# Altium schematic sheet 61204021621.SchDoc
size A; SheetNumber: 1; SheetTotal: 1
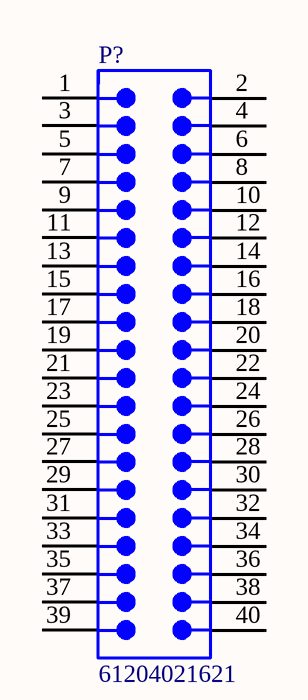
[diagram p0: 61204021621.SchDoc]

## Parts
P?  61204021621  [61204021621]

## Nets

Not connected (* = marked no-connect by the designer): P? 1 2 3 4 5 6 7 8 9 10 11 12 13 14 15 16 17 18 19 20 21 22 23 24 25 26 27 28 29 30 31 32 33 34 35 36 37 38 39 40

## Library data of the parts
P? = CMP-1502-00015-4: WR-BHD Straight Male, Box Header, Through Hole, 2 Rows, 40 Contacts, 2.54mm Pitch; Number of Positions: 40; Contact Resistance: 20mΩ; Current Rating: 3A; Connector Type: Male Pin; Operating Supply Voltage: 250V; Insulation Resistance: 1GΩ; Color: Black; Row Spacing: 2.54mm; Pitch: 2.54mm; RoHS: Compliant; Max Operating Temperature: 105°C; Insulation Material: PBT; Number of Pins: 40; Contact Plating: Gold; Orientation: Vertical; Voltage Rating: 250V; Number of Rows: 2; Lead Pitch: 2.54mm; Length: 58.46mm; Mount: Through Hole; Gender: Male; Number of Contacts: 40; Height: 9.25mm; Min Operating Temperature: -40°C; Contact Material: Gold; Termination: Solder; REACH SVHC: Unknown